# EasyEDA Pro project ProPrj_DevBoard_2026-04-14.epro

# Schematic Schematic1
Board Name: Board1; Create Date: 2026-03-25; Page Name: P1; Project Name: DevBoard; Schematic Name: Schematic1; Update Date: 2026-03-25; Company: EasyEDA.com; Page Size: A4; Version: V1.0
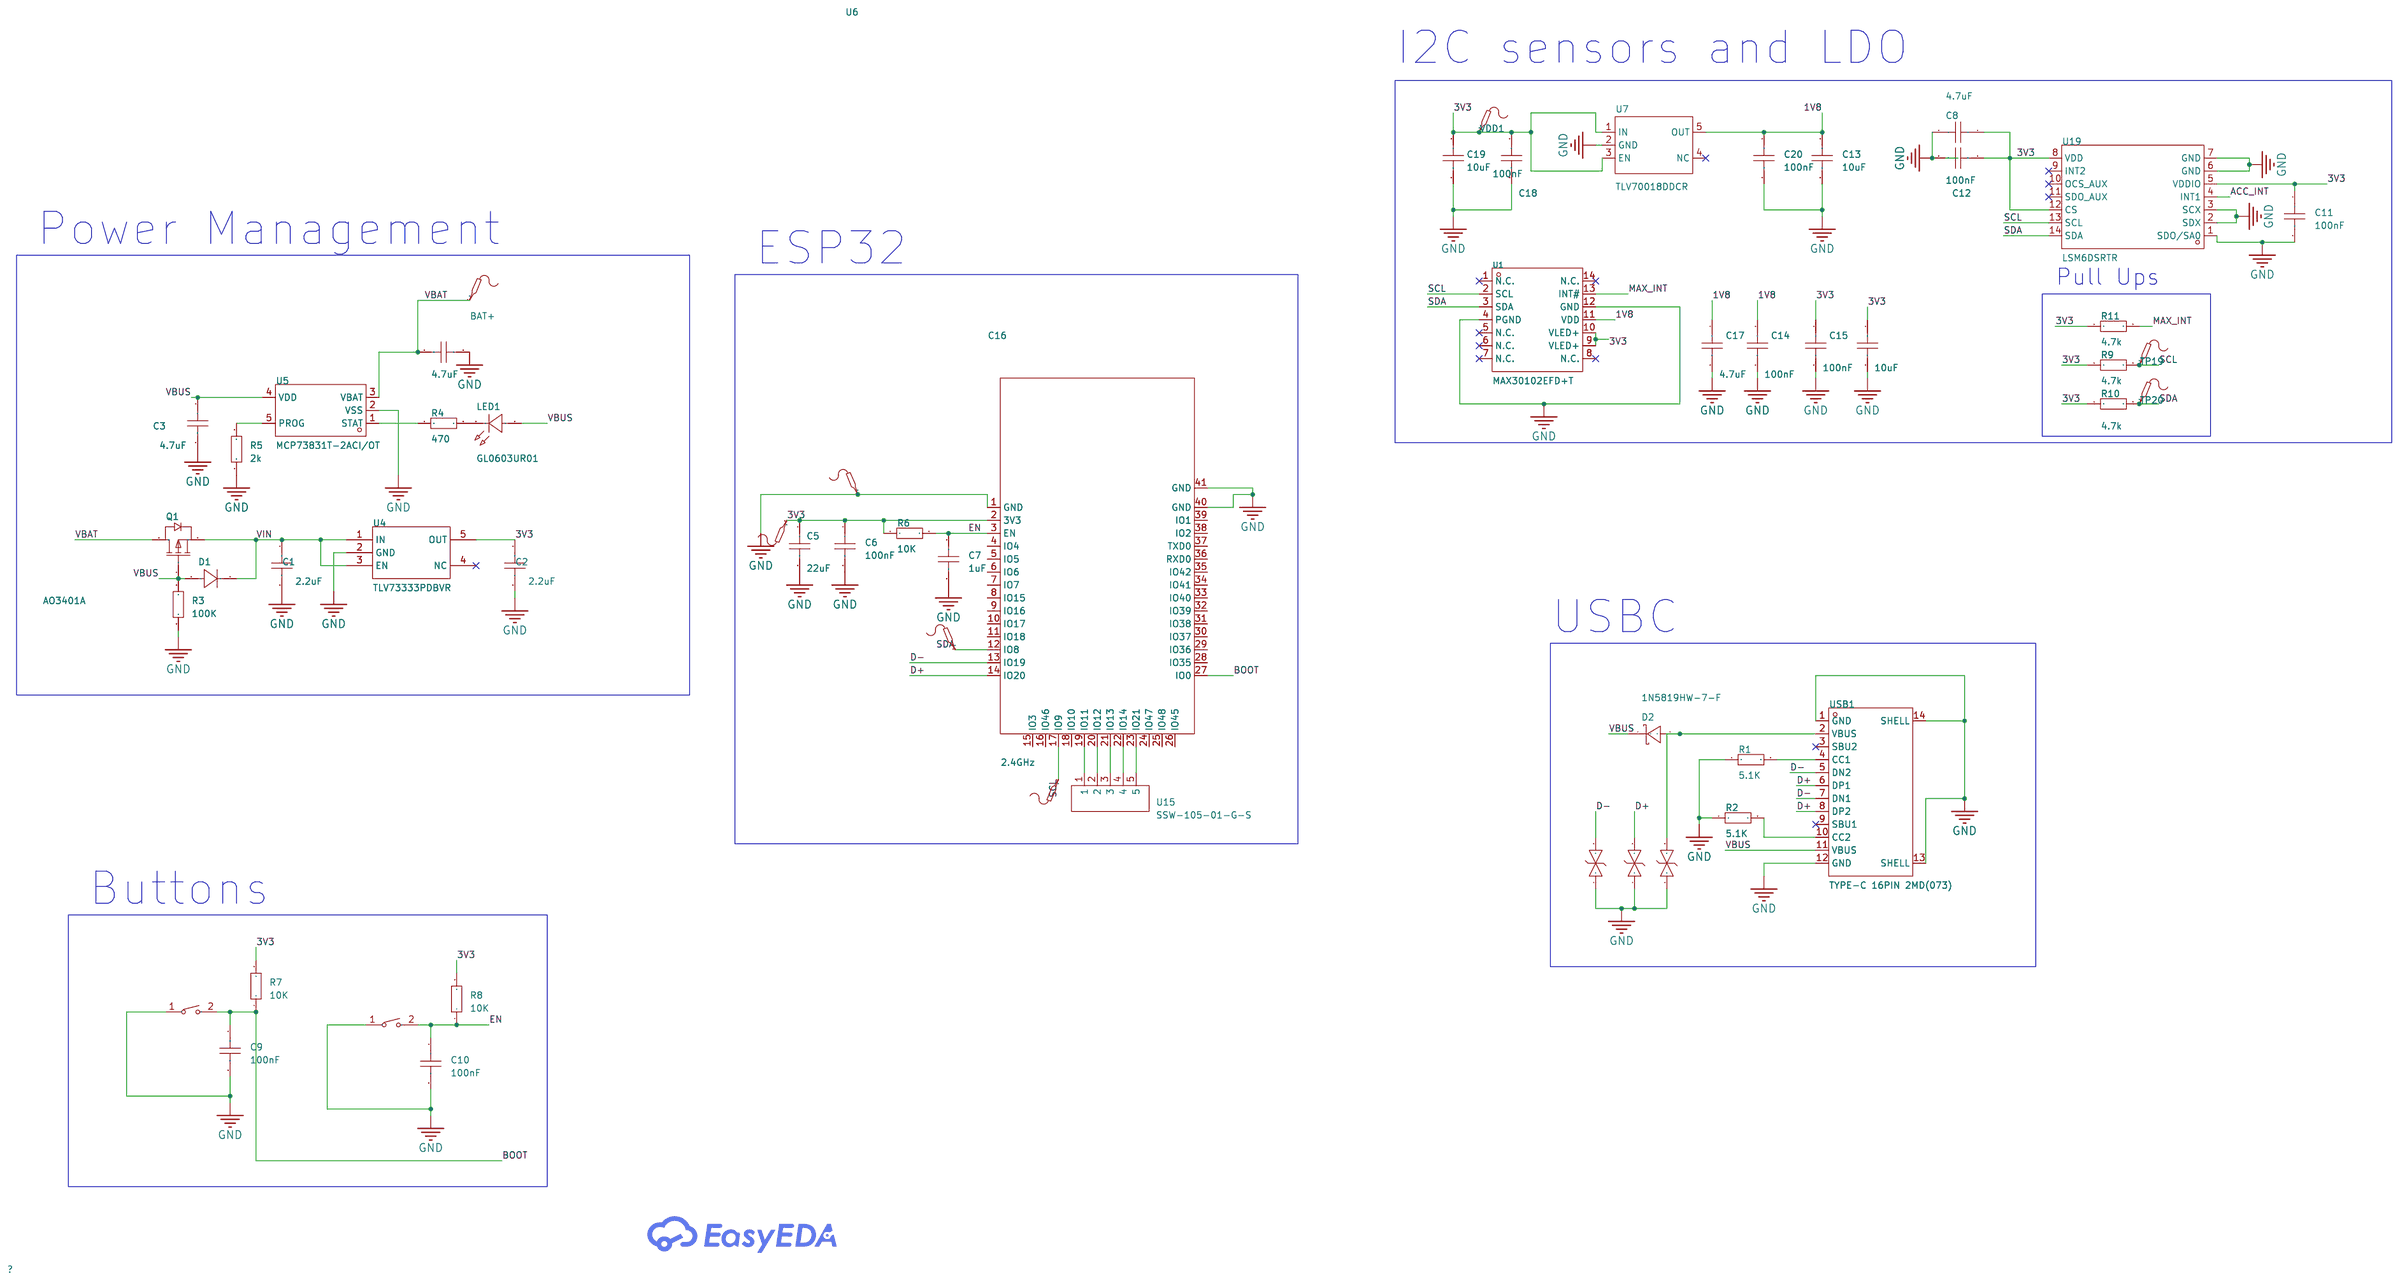
[diagram p0: schematic sheet]

## Parts
BAT+  -  [BAT_SMD]
BAT+1  -  [BAT_SMD]
BAT+2  -  [BAT_SMD]
BAT+3  -  [BAT_SMD]
BAT+4  -  [BAT_SMD]
C1  2.2uF  [C0603]
C2  2.2uF  [C0603]
C3  4.7uF  [C0603]
C4  4.7uF  [C0603]
C5  22uF  [C0603]
C6  100nF  [C0603]
C7  1uF  [C0603]
C8  4.7uF  [C0603]
C9  100nF  [C0603]
C10  100nF  [C0603]
C11  100nF  [C0603]
C12  100nF  [C0603]
C13  10uF  [C0603]
C14  100nF  [C0603]
C15  100nF  [C0603]
C16  10uF  [C0603]
C17  4.7uF  [C0603]
C18  100nF  [C0603]
C19  10uF  [C0603]
C20  100nF  [C0603]
D1  -  [SMA_L4.4-W2.8-LS5.4-RD]
D2  1N5819HW-7-F  [SOD-123_L2.7-W1.6-LS3.7-RD]
LED1  GL0603UR01  [LED0603-FD]
Q1  AO3401A  [SOT-23_L2.9-W1.3-P1.90-LS2.4-BR]
R1  5.1K  [R0603]
R2  5.1K  [R0603]
R3  100K  [R0603]
R4  470  [R0603]
R5  2k  [R0603]
R6  10K  [R0603]
R7  10K  [R0603]
R8  10K  [R0603]
R9  4.7k  [R0603]
R10  4.7k  [R0603]
R11  4.7k  [R0603]
TP19  -  [Test-Point-0.5mm]
TP20  -  [Test-Point-0.5mm]
U1  MAX30102EFD+T  [OESIP-14_L5.6-W3.3-P0.80-TL]
U4  TLV73333PDBVR  [SOT-23-5_L3.0-W1.7-P0.95-LS2.8-BR]
U5  MCP73831T-2ACI/OT  [SOT-23-5_L3.0-W1.7-P0.95-LS2.8-BL]
U6  2.4GHz  [WIRELM-SMD_ESP32-S3-WROOM-1]
U7  TLV70018DDCR  [SOT-23-5_L3.0-W1.7-P0.95-LS2.8-BR]
U8  GT-TC060A-H025-L1  [SW-SMD_L6.1-W3.5-LS8.0]
U9  GT-TC060A-H025-L1  [SW-SMD_L6.1-W3.5-LS8.0]
U15  SSW-105-01-G-S  [HDR-TH_5P-P2.54_SSW-105-01-S-P]
U16  LESD5D5.0CT1G  [SOD-523_L1.2-W0.8-LS1.6-BI]
U17  LESD5D5.0CT1G  [SOD-523_L1.2-W0.8-LS1.6-BI]
U18  LESD5D5.0CT1G  [SOD-523_L1.2-W0.8-LS1.6-BI]
U19  LSM6DSRTR  [LGA-14_L3.0-W2.5-P0.50-BR]
USB1  TYPE-C 16PIN 2MD(073)  [USB-C-SMD_TYPE-C-6PIN-2MD-073]
VDD1  -  [Test-Point-0.5mm]

## Library data of the parts
BAT+ BAT+1-BAT+4 TP19 TP20 VDD1 = Test-Point: Test Point 测试点
C1-C20 = CAP_0603: Supplier Footprint: 0603
D1 = 1N4007: Supplier Footprint: SMA(DO-214AC); Supplier Part: C727081
D2 = 1N5819HW-7-F: Diode Configuration:1 Independent Voltage - Forward(Vf@If):450mV@1A Voltage - DC Reverse(Vr):40V Current - Rectified:1A Reverse Leakage Current (Ir):1mA@40V Operating Junction Temperature Range:-65℃~+150℃ Operating Junction Temperature Range:-65℃~+150℃ No; LCSC Part Name: 电压:40V 电流:1A; Supplier Part: C82544; Manufacturer: DIODES(美台); Supplier Footprint: SOD-123; JLCPCB Part Class: Extended Part; Datasheet: https://item.szlcsc.com/datasheet/1N5819HW-7-F/83701.html; Supplier: LCSC; Diode Configuration: 1 Independent; Voltage - Forward(Vf@If): 450mV@1A; Voltage - DC Reverse(Vr): 40V; Current - Rectified: 1A; Reverse Leakage Current (Ir): 1mA@40V; Operating Junction Temperature Range: -65℃~+150℃; Non-Repetitive Peak Forward Surge Current: 25A
LED1 = GL0603UR01: Illumination Color:Red Voltage - Forward(Vf):2.4V Voltage - Forward(Vf):2.4V Forward Current:20mA Wavelength - Dominant:620nm~625nm Wavelength - Dominant:620nm~625nm Diode Configuration:Discrete Diode Lens Color:Water Clear Luminous Intensity:120mcd Lumin; LCSC Part Name: 0603 红灯 高亮; Supplier Part: C51933292; Manufacturer: Guiguang light(桂光光电); Supplier Footprint: 0603; JLCPCB Part Class: Extended Part; Datasheet: https://item.szlcsc.com/datasheet/GL0603UR01/54645988.html; Supplier: LCSC; Illumination Color: Red; Voltage - Forward(Vf): 2.4V; Forward Current: 20mA; Wavelength - Dominant: 620nm~625nm; Diode Configuration: Discrete Diode; Lens Color: Water Clear; Luminous Intensity: 120mcd; Viewing Angle: 120°; Mounting Style: Top-mount; Operating Temperature: -40℃~+85℃
Q1 = AO3401A_C15127: Number:1 P-Channel Drain to Source Voltage:30V Current - Continuous Drain(Id):4A RDS(on):47mΩ@10V；85mΩ@2.5V；60mΩ@4.5V Pd - Power Dissipation:- Gate Threshold Voltage (Vgs(th)):900mV@250uA Gate Charge(Qg):14nC@10V Input Capacitance(Ciss):645pF Reverse Tran; LCSC Part Name: 1个P沟道 耐压:30V 电流:4A; Supplier Part: C15127; Manufacturer: AOS; Supplier Footprint: SOT-23; JLCPCB Part Class: Basic Part; Datasheet: https://item.szlcsc.com/datasheet/AO3401A/15801.html; Supplier: LCSC; Number: 1 P-Channel; Drain to Source Voltage: 30V; Current - Continuous Drain(Id): 4A; RDS(on): 47mΩ@10V；85mΩ@2.5V；60mΩ@4.5V; Gate Threshold Voltage (Vgs(th)): 900mV@250uA; Gate Charge(Qg): 14nC@10V; Input Capacitance(Ciss): 645pF; Reverse Transfer Capacitance (Crss@Vds): 55pF; Output Capacitance(Coss): 80pF
R1-R11 = Res_0603: Supplier Footprint: 0603
U1 = MAX30102EFD+T_C6454833: Operating Temperature:-40℃~+85℃ Operating Temperature:-40℃~+85℃; LCSC Part Name: 高灵敏度脉搏血氧仪和心率传感器; Supplier Part: C6454833; Manufacturer: ADI(亚德诺)/MAXIM(美信); Supplier Footprint: OESIP-14; JLCPCB Part Class: Extended Part; Datasheet: https://item.szlcsc.com/datasheet/MAX30102EFD%252BT/7407610.html; Supplier: LCSC; Operating Temperature: -40℃~+85℃
U4 = TLV73333PDBVR: Output Type:Fixed Voltage - Supply:5.5V Output Voltage:3.3V Output Voltage:3.3V Output Current:300mA Power Supply Rejection Ratio (PSRR):50dB@(1kHz) Voltage Dropout:125mV@(300mA) standby current:34uA Noise:28uVrms Features:Under Voltage Lockout；Over Curre; LCSC Part Name: 3.3V 300mA 5.5V; Supplier Part: C134139; Manufacturer: TI(德州仪器); Supplier Footprint: SOT-23-5; JLCPCB Part Class: Extended Part; Datasheet: https://www.ti.com/cn/lit/gpn/tlv733p; Supplier: LCSC; Output Type: Fixed; Voltage - Supply: 5.5V; Output Voltage: 3.3V; Output Current: 300mA; Power Supply Rejection Ratio (PSRR): 50dB@(1kHz); Voltage Dropout: 125mV@(300mA); standby current: 34uA; Noise: 28uVrms; Features: Under Voltage Lockout；Over Current Protection；Enable；Over Temperature Protection; Operating Temperature: -40℃~+125℃@(Tj); Output Configuration: Positive; Number of Outputs: 1
U5 = MCP73831T-2ACI/OT: The Chip Type:Charging IC Voltage - Supply:3.75V~6V Voltage - Supply:3.75V~6V Charge Current - Max:550mA Charging Saturation Voltage:4.2V End-Off Voltage:- Type of Battery:Lithium Battery Number of Cells:1 Number of Cells:1 Operating Temperature:-40℃~+85℃; LCSC Part Name: 单节锂离子/锂聚合物充电管理控制器; Supplier Part: C424093; Manufacturer: MICROCHIP(美国微芯); Supplier Footprint: SOT-23-5; JLCPCB Part Class: Extended Part; Datasheet: https://item.szlcsc.com/datasheet/MCP73831T-2ACI%252FOT/417116.html; Supplier: LCSC; The Chip Type: Charging IC; Voltage - Supply: 3.75V~6V; Charge Current - Max: 550mA; Charging Saturation Voltage: 4.2V; Type of Battery: Lithium Battery; Number of Cells: 1; Operating Temperature: -40℃~+85℃; Battery Temperature Detection: Not supported; Supply Current (Iq): 53uA
U6 = ESP32-S3-WROOM-1-N16R8: Utilized IC / Part:ESP32-S3R8 Interface Type:I2C；GPIO；UART；SPI；USB；I2S Frequency:2.4GHz Antenna Type:On-board PCB Antenna Output Power:20.5dBm Output Power:20.5dBm Voltage - Supply:3V~3.6V Voltage - Supply:3V~3.6V Receive  Current:95mA Send  Current:355mA; LCSC Part Name: 不带固件 通用型Wi-Fi+低功耗蓝牙MCU模组; Supplier Part: C2913202; Manufacturer: ESPRESSIF(乐鑫); Supplier Footprint: SMD,25.5x18mm; JLCPCB Part Class: Extended Part; Datasheet: https://item.szlcsc.com/datasheet/ESP32-S3-WROOM-1-N16R8/3198300.html; Supplier: LCSC; Utilized IC / Part: ESP32-S3R8; Interface Type: I2C；GPIO；UART；SPI；USB；I2S; Antenna Type: On-board PCB Antenna; Output Power: 20.5dBm; Voltage - Supply: 3V~3.6V; Receive  Current: 95mA; Send  Current: 355mA; Sensitivity: -103.5dBm; Operating Temperature: -40℃~+65℃
U7 = TLV70018DDCR: Output Type:Fixed Maximum Input Voltage:5.5V Output Voltage:1.8V Output Voltage:1.8V Output Current:200mA Power Supply Rejection Ratio (PSRR):68dB@(1kHz) Dropout Voltage:250mV@(200mA) standby current:55uA Feature:防静电保护；低ESR；Thermal Protection(TSD)；欠压闭锁；Ov; LCSC Part Name: 具有使能功能的 200mA、高 PSRR、低 IQ、低压降稳压器; Supplier Part: C79924; Manufacturer: TI(德州仪器); Supplier Footprint: SOT-23-5; JLCPCB Part Class: Extended Part; Datasheet: https://www.ti.com/cn/lit/gpn/tlv700; Supplier: LCSC; Output Type: Fixed; Maximum Input Voltage: 5.5V; Output Voltage: 1.8V; Output Current: 200mA; Power Supply Rejection Ratio (PSRR): 68dB@(1kHz); Dropout Voltage: 250mV@(200mA); standby current: 55uA; Feature: 防静电保护；低ESR；Thermal Protection(TSD)；欠压闭锁；Overcurrent Protection(OCP)；带使能; Operating Temperature: -40℃~+125℃@(Tj); Output Polarity: Positive electrode; Number of Outputs: 1
U8 U9 = GT-TC060A-H025-L1: Circuit:SPST Actuator Style:Rectangular Button Operating Force:1.6N Mounting Type:Surface Mount,Vertical Length:6.05mm Width:3.5mm Switch Height:2.5mm with Bracket:Without Bracket Contact Current:50mA Voltage Rating:12V Actuator/Cap Color:White With Lamp:; LCSC Part Name: 3x6 两脚立式轻触开关 H2.5mm 160gf; Supplier Part: C5117870; Manufacturer: G-Switch(品赞); Supplier Footprint: SMD,6.1x3.5mm; JLCPCB Part Class: Extended Part; Datasheet: https://item.szlcsc.com/datasheet/GT-TC060A-H025-L1/5694726.html; Supplier: LCSC; Circuit: SPST; Actuator Style: Rectangular Button; Operating Force: 1.6N; Mounting Type: Surface Mount,Vertical; Length: 6.05mm; Width: 3.5mm; Switch Height: 2.5mm; with Bracket: Without Bracket; Contact Current: 50mA; Voltage Rating: 12V; Actuator/Cap Color: White; With Lamp: No; Termination Style: PC Pin; Life: 100,000 Cycles; Operating Temperature: -30℃~+85℃
U15 = SSW-105-01-G-S: Holes Structure:1x5P Pitch:2.54mm Row Spacing:- Circular Hole / Square Hole:Square Hole Mounting Type:Through Hole Number of Rows:1 Number of Positions:5P Current Rating:4.7A Voltage Rating (Max):655V Holes Direction:Top Insulation Height:8.51mm Contact P; LCSC Part Name: 1x5P 间距:2.54mm 直插; Supplier Part: C6825529; Manufacturer: SAMTEC; Supplier Footprint: 插件,P=2.54mm; JLCPCB Part Class: Extended Part; Datasheet: https://item.szlcsc.com/datasheet/SSW-105-01-G-S/7787558.html; Supplier: LCSC; Holes Structure: 1x5P; Pitch: 2.54mm; Circular Hole / Square Hole: Square Hole; Mounting Type: Through Hole; Number of Rows: 1; Number of Positions: 5P; Current Rating: 4.7A; Voltage Rating (Max): 655V; Holes Direction: Top; Insulation Height: 8.51mm; Contact Plating: Gold; Operating Temperature: -55℃~+125℃
U16-U18 = LESD5D5.0CT1G_C7433850: Polarity:- Reverse Stand-Off Voltage (Vrwm):5V Clamping Voltage:15V Peak Pulse Current (Ipp):5A Peak Pulse Power Dissipation (Ppp):75W Voltage - Breakdown:9V Reverse Leakage Current (Ir):1uA Number of Channels:1.0 Operating Temperature:-40℃~+150℃ Operatin; Supplier Part: C7433850; Manufacturer: KUU; Supplier Footprint: SOD-523; JLCPCB Part Class: Extended Part; Datasheet: https://item.szlcsc.com/datasheet/LESD5D5.0CT1G/8442902.html; Supplier: LCSC; Reverse Stand-Off Voltage (Vrwm): 5V; Clamping Voltage: 15V; Peak Pulse Current (Ipp): 5A; Peak Pulse Power Dissipation (Ppp): 75W; Voltage - Breakdown: 9V; Reverse Leakage Current (Ir): 1uA; Number of Channels: 1.0; Operating Temperature: -40℃~+150℃; level of protection: IEC 61000-4-2；IEC 61000-4-4; Type: ESD; Junction Capacitance: 15pF
U19 = LSM6DSRTR: Accelerometer Sensing Axis:X,Y,Z Acceleration Measurement Range (MAX):±16g Acceleration Measurement Range (MAX):±16g Gyroscope Sensing Axis:X,Y,Z Gyroscope Measurement Range (MAX):±4000dps Gyroscope Measurement Range (MAX):±4000dps Sensor Type:Acceleromet; LCSC Part Name: iNEMO惯性模块:常开3D加速度计和3D陀螺仪; Supplier Part: C784817; Manufacturer: ST(意法半导体); Supplier Footprint: LGA-14(2.5x3); JLCPCB Part Class: Extended Part; Datasheet: https://item.szlcsc.com/datasheet/LSM6DSRTR/840864.html; Supplier: LCSC; Accelerometer Sensing Axis: X,Y,Z; Acceleration Measurement Range (MAX): ±16g; Gyroscope Sensing Axis: X,Y,Z; Gyroscope Measurement Range (MAX): ±4000dps; Sensor Type: Accelerometer Gyroscope; Interface: I2C；SPI；MIPI I3C; Voltage - Supply: 1.71V~3.6V; Cache Size: 9KB; Operating Temperature: -40℃~+85℃
USB1 = TYPE-C 16PIN 2MD(073): Connector Type:Type-C Protocol Standard:- Gender:Female Mounting Type:Surface Mount, Right Angle Number of Contacts:16P Number of Ports:1 Current Rating-Power:3A Voltage Rating:5V Connect-Disconnect Life:5,000 times Supplementary Features:- Center Height:; LCSC Part Name: 16P卧贴母座; Supplier Part: C2765186; Manufacturer: SHOU HAN(首韩); Supplier Footprint: SMD; JLCPCB Part Class: Extended Part; Datasheet: https://item.szlcsc.com/datasheet/TYPE-C%252016PIN%25202MD(073)/2901843.html; Supplier: LCSC; Connector Type: Type-C; Gender: Female; Mounting Type: Surface Mount, Right Angle; Number of Contacts: 16P; Number of Ports: 1; Current Rating-Power: 3A; Voltage Rating: 5V; Connect-Disconnect Life: 5,000 times; Detection color: Black; Operating Temperature: -25℃~+85℃

## Nets
1V8: C13.1 C14.1 C17.1 C20.1 U1.11(VDD) U7.5(OUT)
3V3: BAT+3.1 C2.1 C5.1 C6.1 C8.1 C11.1 C12.1 C15.1 C16.1 C18.1 C19.1 R6.1 R7.2 R8.2 R9.1 R10.1 R11.1 U1.9(VLED+) U1.10(VLED+) U4.5(OUT) U6.2(3V3) U7.1(IN) U7.3(EN) U19.5(VDDIO) U19.8(VDD) U19.12(CS) VDD1.1
GND: BAT+4.1 C1.2 C2.2 C3.2 C4.2 C5.2 C6.2 C7.2 C8.2 C9.2 C10.2 C11.2 C12.2 C13.2 C14.2 C15.2 C16.2 C17.2 C18.2 C19.2 C20.2 R1.1 R2.1 R3.1 R5.1 U1.4(PGND) U1.12(GND) U4.2(GND) U5.2(VSS) U6.1(GND) U6.40(GND) U6.41(GND) U7.2(GND) U8.1 U9.1 U16.1 U17.1 U18.1 U19.1(SDO/SA0) U19.2(SDX) U19.3(SCX) U19.6(GND) U19.7(GND) USB1.1(GND) USB1.12(GND) USB1.13(SHELL) USB1.14(SHELL)
VBAT: BAT+.1 C4.1 Q1.3(D) U5.3(VBAT)
VBUS: C3.1 D1.2(A) D2.1(K) LED1.1(A) Q1.1(G) R3.2 U5.4(VDD) USB1.11(VBUS)
VIN: C1.1 D1.1(K) Q1.2(S) U4.1(IN) U4.3(EN)
ACC_INT: U19.4(INT1)
BOOT: C9.1 R7.1 U6.27(IO0) U8.2
D+: U6.14(IO20) U17.2 USB1.6(DP1) USB1.8(DP2)
D-: U6.13(IO19) U16.2 USB1.5(DN2) USB1.7(DN1)
EN: C7.1 C10.1 R6.2 R8.1 U6.3(EN) U9.2
MAX_INT: R11.2 U1.13(INT#)
SCL: BAT+1.1 R9.2 TP19.1 U1.2(SCL) U6.17(IO9) U19.13(SCL)
SDA: BAT+2.1 R10.2 TP20.1 U1.3(SDA) U6.12(IO8) U19.14(SDA)
$1N1234: D2.2(A) U18.2 USB1.2(VBUS)
$1N4701: U6.19(IO11) U15.1
$1N4705: U6.20(IO12) U15.2
$1N4710: U6.21(IO13) U15.3
$1N4715: U6.22(IO14) U15.4
$1N4720: U6.23(IO21) U15.5
Net-(LED1-2): LED1.2(C) R4.2
Net-(R1-2): R1.2 USB1.4(CC1)
Net-(R2-2): R2.2 USB1.10(CC2)
Net-(R4-1): R4.1 U5.1(STAT)
Net-(R5-2): R5.2 U5.5(PROG)

Not connected (* = marked no-connect by the designer): U1 1(N.C.)* 5(N.C.)* 6(N.C.)* 7(N.C.)* 8(N.C.)* 14(N.C.)*; U4 4(NC)*; U6 4(IO4) 5(IO5) 6(IO6) 7(IO7) 8(IO15) 9(IO16) 10(IO17) 11(IO18) 15(IO3) 16(IO46) 18(IO10) 24(IO47) 25(IO48) 26(IO45) 28(IO35) 29(IO36) 30(IO37) 31(IO38) 32(IO39) 33(IO40) 34(IO41) 35(IO42) 36(RXD0) 37(TXD0) 38(IO2) 39(IO1); U7 4(NC)*; U19 9(INT2)* 10(OCS_AUX)* 11(SDO_AUX)*; USB1 3(SBU2)* 9(SBU1)*

## Notes on the sheet
- I2C sensors and LDO
- Power Management
- ESP32
- Pull Ups
- USBC
- Buttons

# Board PCB1
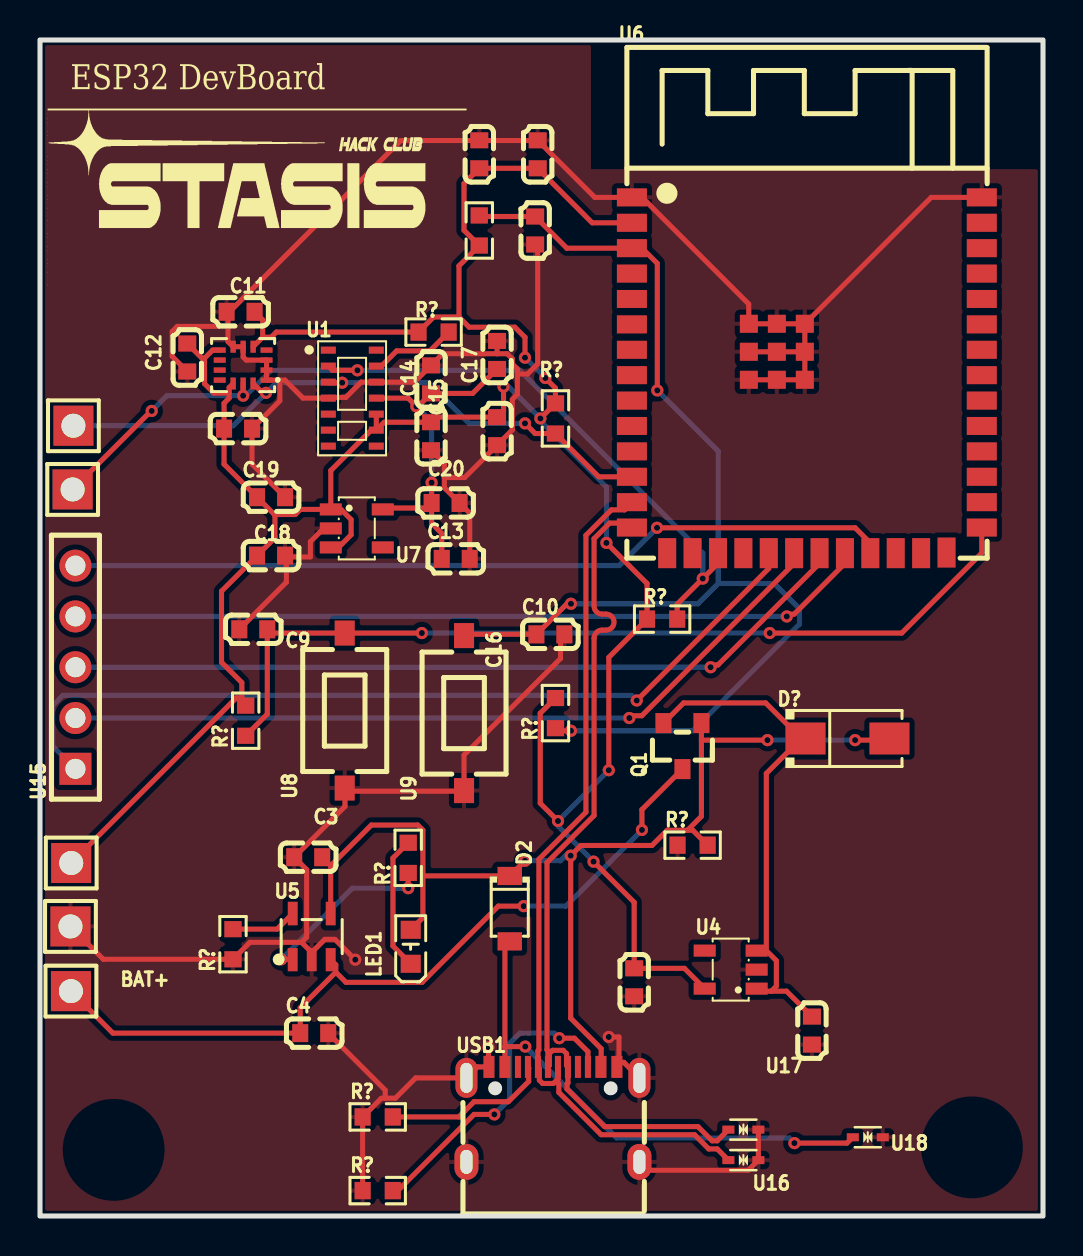
[diagram p1: board, top side]
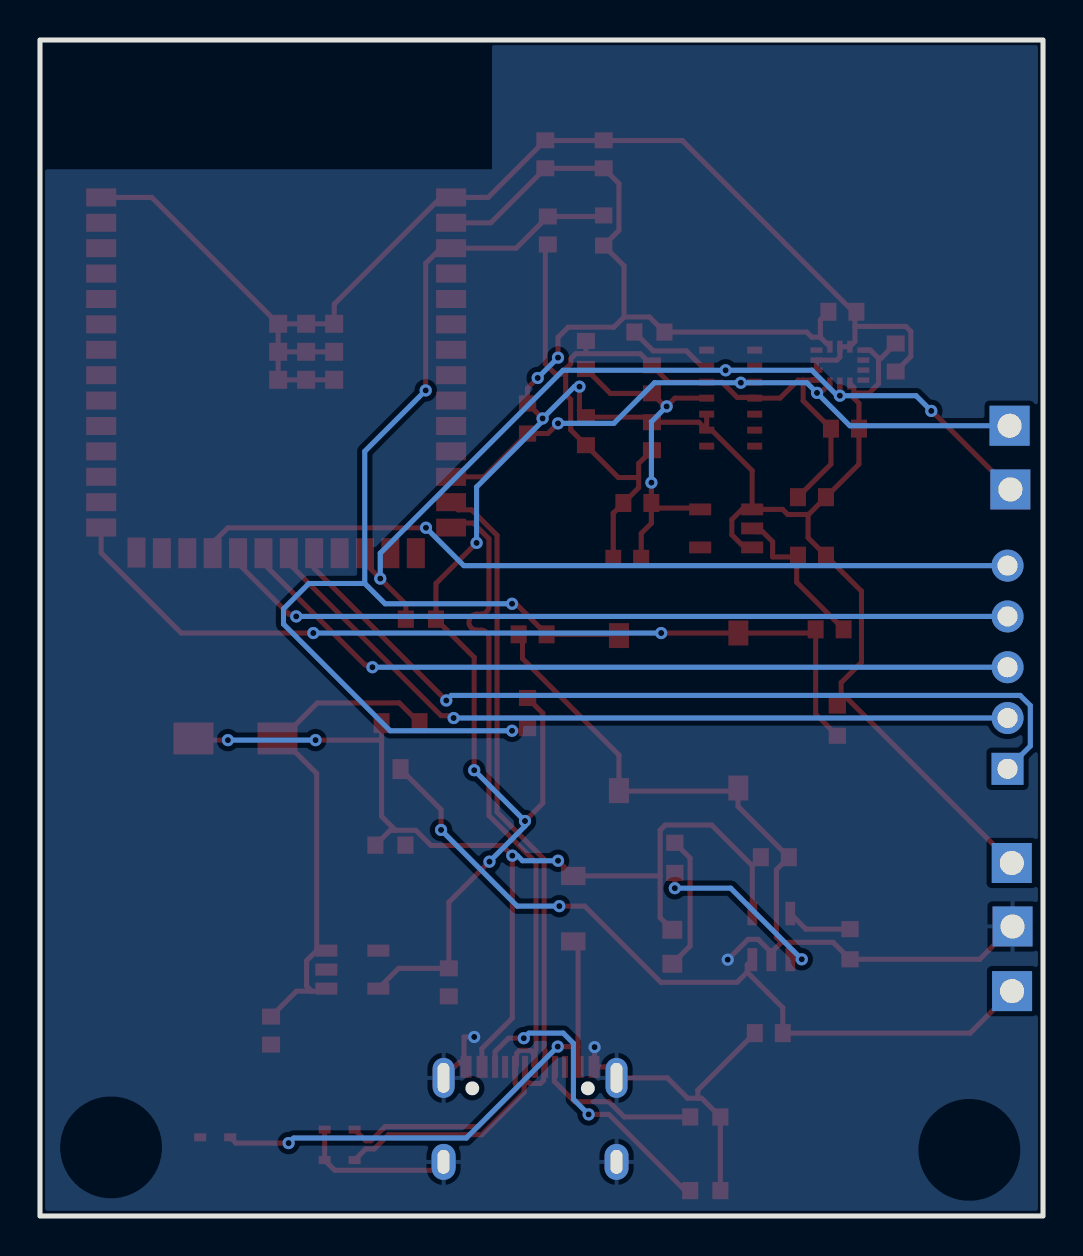
[diagram p2: board, bottom side, seen from below]

Outline 50.16 x 58.8 mm; copper layers: Top Layer, Bottom Layer. Coordinates in mm from the lower left corner of the outline.
Outline path: rectangle 0,58.8 50.16,0
Stack: Top Layer 0.035mm / Dielectric1 1.51mm FR4 er 4.5 / Bottom Layer 0.035mm

## Design rules (mm)
net D-: DP1
net D+: DP1
template: JLCPCB Capability(Two Layers Board)
spacing copperThickness1oz (default): track to track 0.102, other pairs 0.152 to 0.3
spacing copperThickness2oz: track to track 0.203, other pairs 0.152 to 0.3
track width copperThickness1oz (default): min 0.127, default 0.254, max 2.54
track width copperThickness2oz: min 0.203, default 0.254, max 2.54
differential pair differentialPair (default): width min 0.127, default 0.254, max 2.54; gap min 0.152, default 0.152
via viaSize (default): diameter min 0.5, default 0.61, max 10; hole min 0.3, default 0.305, max 6.3

## Placement (name value [footprint] x y rotation side)
BAT+  -  [BAT_SMD]  1.55 11.24 0 top
BAT+1  -  [BAT_SMD]  1.63 36.33 0 top
BAT+2  -  [BAT_SMD]  1.67 39.51 0 top
BAT+3  -  [BAT_SMD]  1.56 17.65 0 top
BAT+4  -  [BAT_SMD]  1.52 14.48 0 top
C1  2.2uF  [C0603]  38.61 9.27 270 top
C2  2.2uF  [C0603]  29.72 11.68 270 top
C3  4.7uF  [C0603]  13.41 17.94 180 top
C4  4.7uF  [C0603]  13.72 9.14 0 top
C5  22uF  [C0603]  21.97 53.09 90 top
C6  100nF  [C0603]  24.89 53.09 90 top
C7  1uF  [C0603]  24.76 49.28 270 top
C8  4.7uF  [C0603]  9.91 39.37 0 top
C9  100nF  [C0603]  10.67 29.34 180 top
C10  100nF  [C0603]  25.53 29.08 0 top
C11  100nF  [C0603]  10.03 45.21 180 top
C12  100nF  [C0603]  7.37 42.93 270 top
C13  10uF  [C0603]  20.79 32.86 0 top
C14  100nF  [C0603]  19.56 41.83 90 top
C15  100nF  [C0603]  19.56 38.99 270 top
C16  10uF  [C0603]  22.86 39.24 270 top
C17  4.7uF  [C0603]  22.86 43.05 90 top
C18  100nF  [C0603]  11.56 33.02 0 top
C19  10uF  [C0603]  11.56 35.94 0 top
C20  100nF  [C0603]  20.29 35.65 0 top
D2  1N5819HW-7-F  [SOD-123_L2.7-W1.6-LS3.7-RD]  23.5 15.37 270 top
D?  1N4007  [SMA_L4.3-W2.5-LS5.0-RD]  40.39 23.88 0 top
LED1  GL0603UR01  [LED0603-FD]  18.54 13.46 270 top
Q1  AO3401A  [SOT-23_L2.9-W1.3-P1.90-LS2.4-BR]  32.13 23.5 90 top
R?  -  [R0603]  32.64 18.54 0 top
R?#2  -  [R0603]  18.41 17.91 90 top
R?#3  -  [R0603]  9.65 13.59 90 top
R?#4  -  [R0603]  21.97 49.28 90 top
R?#5  -  [R0603]  10.29 24.77 90 top
R?#6  -  [R0603]  25.78 25.15 90 top
R?#7  -  [R0603]  31.11 29.85 0 top
R?#8  -  [R0603]  25.78 39.88 270 top
R?#9  -  [R0603]  19.69 44.2 0 top
R?#10  -  [R0603]  16.89 4.95 0 top
R?#11  -  [R0603]  16.89 1.27 0 top
U1  MAX30102EFD+T  [OESIP-14_L5.6-W3.3-P0.80-TL]  15.62 40.89 0 top
U4  TLV73333PDBVR  [SOT-23-5_L3.0-W1.7-P0.95-LS2.8-BR]  34.54 12.32 0 top
U5  MCP73831T-2ACI/OT  [SOT-23-5_L3.0-W1.7-P0.95-LS2.8-BL]  13.59 13.97 0 top
U6  2.4GHz  [WIRELM-SMD_ESP32-S3-WROOM-1]  38.35 42.04 0 top
U7  TLV70018DDCR  [SOT-23-5_L3.0-W1.7-P0.95-LS2.8-BR]  15.84 34.38 180 top
U8  GT-TC060A-H025-L1  [SW-SMD_L6.1-W3.5-LS8.0]  15.24 25.27 90 top
U9  GT-TC060A-H025-L1  [SW-SMD_L6.1-W3.5-LS8.0]  21.21 25.15 90 top
U15  SSW-105-01-G-S  [HDR-TH_5P-P2.54_SSW-105-01-S-P]  1.77 27.44 90 top
U16  LESD5D5.0CT1G  [SOD-523_L1.2-W0.8-LS1.6-BI]  35.18 2.79 180 top
U17  LESD5D5.0CT1G  [SOD-523_L1.2-W0.8-LS1.6-BI]  35.18 4.32 180 top
U18  LESD5D5.0CT1G  [SOD-523_L1.2-W0.8-LS1.6-BI]  41.4 3.94 180 top
U19  LSM6DSRTR  [LGA-14_L3.0-W2.5-P0.50-BR]  10.16 42.55 0 top
USB1  TYPE-C 16PIN 2MD(073)  [USB-C-SMD_TYPE-C-6PIN-2MD-073]  25.65 5.08 0 top

## Footprints (pads in the part's own frame, mm; a bottom-side part is the same pattern mirrored in y, then rotated)
BAT_SMD
  rect 2x2 hole 1.2: 1(0,0)
C0603
  rect 0.8x0.9 smd: 1(-0.7,0) 2(0.7,0)
HDR-TH_5P-P2.54_SSW-105-01-S-P
  rect 1.6x1.6 hole 1: 1(-5.08,0)
  round 1.6 hole 1: 2(-2.54,0) 3(0,0) 4(2.54,0) 5(5.08,0)
LED0603-FD
  rect 0.9x1 smd: 1(-0.85,0) 2(0.85,0)
LGA-14_L3.0-W2.5-P0.50-BR
  rect 0.6x0.27 smd: 1(1.17,-0.75) 2(1.17,-0.25) 3(1.17,0.25) 4(1.17,0.75) 8(-1.17,0.75) 9(-1.17,0.25) 10(-1.17,-0.25) 11(-1.17,-0.75)
  rect 0.27x0.6 smd: 5(0.5,0.92) 6(0,0.92) 7(-0.5,0.92) 12(-0.5,-0.92) 13(0,-0.92) 14(0.5,-0.92)
OESIP-14_L5.6-W3.3-P0.80-TL
  rect 0.75x0.35 smd: 1(-1.2,2.4) 2(-1.2,1.6) 3(-1.2,0.8) 4(-1.2,0) 5(-1.2,-0.8) 6(-1.2,-1.6) 7(-1.2,-2.4) 8(1.2,-2.4) 9(1.2,-1.6) 10(1.2,-0.8) 11(1.2,0) 12(1.2,0.8) 13(1.2,1.6) 14(1.2,2.4)
R0603
  rect 0.806x0.864 smd: 1(-0.753,0) 2(0.753,0)
SMA_L4.3-W2.5-LS5.0-RD
  rect 2x1.593 smd: 1(-2.1,0) 2(2.1,0)
SOD-123_L2.7-W1.6-LS3.7-RD
  rect 0.91x1.22 smd: 1(-1.635,0) 2(1.635,0)
SOD-523_L1.2-W0.8-LS1.6-BI
  rect 0.6x0.4 smd: 1(-0.75,0) 2(0.75,0)
SOT-23-5_L3.0-W1.7-P0.95-LS2.8-BL
  rect 0.49x1.157 smd: 1(-0.95,-1.153) 2(0,-1.153) 3(0.95,-1.153)
  rect 0.49x1.175 smd: 4(0.95,1.153) 5(-0.95,1.153)
SOT-23-5_L3.0-W1.7-P0.95-LS2.8-BR
  rect 1.1x0.6 smd: 1(1.3,-0.95) 2(1.3,0) 3(1.3,0.95) 4(-1.3,0.95) 5(-1.3,-0.95)
SOT-23_L2.9-W1.3-P1.90-LS2.4-BR
  rect 1x0.8 smd: 1(1.15,-0.95) 2(1.15,0.95) 3(-1.15,0)
SW-SMD_L6.1-W3.5-LS8.0
  rect 1.25x1 smd: 1(-3.875,0) 2(3.875,0)
USB-C-SMD_TYPE-C-6PIN-2MD-073
  rect 0.55x1.1 smd: 1(-3.2,2.375) 2(-2.4,2.375) 11(2.4,2.375) 12(3.2,2.375)
  rect 0.3x1.1 smd: 3(-1.75,2.375) 4(-1.25,2.375) 5(-0.75,2.375) 6(-0.25,2.375) 7(0.25,2.375) 8(0.75,2.375) 9(1.25,2.375) 10(1.75,2.375)
  oval 1.1x2 hole 0.6x1.5: 13(-4.325,1.825) 14(4.325,1.825)
  oval 1.2x1.8 hole 0.6x1.2: 13(-4.325,-2.375) 14(4.325,-2.375)
WIRELM-SMD_ESP32-S3-WROOM-1
  rect 1.5x0.9 smd: 1(-8.75,8.895) 2(-8.75,7.625) 3(-8.75,6.355) 4(-8.75,5.085) 5(-8.75,3.815) 6(-8.75,2.545) 7(-8.75,1.275) 8(-8.75,0.005) 9(-8.75,-1.265) 10(-8.75,-2.535) 11(-8.75,-3.805) 12(-8.75,-5.075) 13(-8.75,-6.345) 14(-8.75,-7.615) 27(8.75,-7.615) 28(8.75,-6.345) 29(8.75,-5.075) 30(8.75,-3.805) 31(8.75,-2.535) 32(8.75,-1.265) 33(8.75,0.005) 34(8.75,1.275) 35(8.75,2.545) 36(8.75,3.815) 37(8.75,5.085) 38(8.75,6.355) 39(8.75,7.625) 40(8.75,8.895)
  rect 0.9x1.5 smd: 15(-6.985,-8.895) 16(-5.715,-8.895) 17(-4.445,-8.895) 18(-3.175,-8.895) 19(-1.905,-8.895) 20(-0.635,-8.895) 21(0.635,-8.895) 22(1.905,-8.895) 23(3.175,-8.895) 24(4.445,-8.895) 25(5.715,-8.895) 26(6.985,-8.865)
  rect 0.9x0.9 smd: 41(-2.9,2.575) 41(-2.9,1.175) 41(-2.9,-0.225) 41(-1.5,2.575) 41(-1.5,1.175) 41(-1.5,-0.225) 41(-0.1,2.575) 41(-0.1,1.175) 41(-0.1,-0.225)

## Nets
1V8: C13.1 C14.1 C17.1 C20.1 U1.11 U7.5
3V3: BAT+3.1 C2.1 C5.1 C6.1 C8.1 C11.1 C12.1 C15.1 C16.1 C18.1 C19.1 R?#4.1 R?#5.2 R?#6.2 R?#7.1 R?#8.1 R?#9.1 U1.9 U1.10 U4.5 U6.2 U7.1 U7.3 U19.5 U19.8 U19.12
GND: BAT+4.1 C1.2 C2.2 C3.2 C4.2 C5.2 C6.2 C7.2 C8.2 C9.2 C10.2 C11.2 C12.2 C13.2 C14.2 C15.2 C16.2 C17.2 C18.2 C19.2 C20.2 R?.1 R?#3.1 R?#10.1 R?#11.1 U1.4 U1.12 U4.2 U5.2 U6.1 U6.40 U6.41 U7.2 U8.1 U9.1 U16.1 U17.1 U18.1 U19.1 U19.2 U19.3 U19.6 U19.7 USB1.1 USB1.12 USB1.13 USB1.14
VBAT: BAT+.1 C4.1 Q1.3 U5.3
VBUS: C3.1 D2.1 D?.2 LED1.1 Q1.1 R?.2 U5.4 USB1.11
VIN: C1.1 D?.1 Q1.2 U4.1 U4.3
ACC_INT: U19.4
BOOT: C9.1 R?#5.1 U6.27 U8.2
D+: U6.14 U17.2 USB1.6 USB1.8
D-: U6.13 U16.2 USB1.5 USB1.7
EN: C7.1 C10.1 R?#4.2 R?#6.1 U6.3 U9.2
MAX_INT: R?#9.2 U1.13
SCL: BAT+1.1 R?#7.2 U1.2 U6.17 U19.13
SDA: BAT+2.1 R?#8.2 U1.3 U6.12 U19.14
$1N1234: D2.2 U18.2 USB1.2
$1N1413: R?#10.2 USB1.4
$1N1417: R?#11.2 USB1.10
$1N2229: LED1.2 R?#2.2
$1N2233: R?#2.1 U5.1
$1N2261: R?#3.2 U5.5
$1N4701: U6.19 U15.1
$1N4705: U6.20 U15.2
$1N4710: U6.21 U15.3
$1N4715: U6.22 U15.4
$1N4720: U6.23 U15.5

Pads without a net: U1 1 5 6 7 8 14; U4 4; U6 4 5 6 7 8 9 10 11 15 16 18 24 25 26 28 29 30 31 32 33 34 35 36 37 38 39; U7 4; U19 9 10 11; USB1 3 9

## Via types
v1: diameter 0.61, hole 0.305, Top Layer to Bottom Layer, 42 vias

## Routing (per net, layer and track width the routed paths; a pad name or vN(x,y) marks a point on that pad's centre or on a via; arc(x,y) is an arc through that point)
1V8: length 17.6
  Top Layer w0.254: 19.59,35.4 19.59,34.64 20.09,34.13 C13.1 ; 19.59,35.4 C20.1 v1(19.59,36.67) ; 19.59,35.4 17.21,35.4 U7.5 ; C17.1 21.64,41.13 19.56,41.13 18.91,40.48 v1(18.82,40.48) 18.41,40.89 16.82,40.89
  Bottom Layer w0.254: v1(19.59,36.67) 19.59,39.72 v1(18.82,40.48)
3V3: length 140.4
  Top Layer w0.254: v1(28.33,33.66) 30.36,31.62 R?#7.1 28.45,27.93 v1(28.45,22.29) ; U7.1 13.02,35.33 12.77,35.08 11.75,35.08 ; U7.1 14.54,37.27 16.57,39.29 16.82,39.29 ; U7.1 15.05,35.33 15.56,34.82 15.56,34.06 14.93,33.43 U7.3 ; 9.46,41.15 9.46,41.43 U19.12 ; 9.46,41.15 8.7,41.15 8.23,41.62 8.23,42.89 ; 9.46,41.15 9.46,40.89 9.21,40.64 C8.1 9.21,37.59 C19.1 11.72,35.08 11.75,35.08 ; v1(25.27,41.9) 25.78,41.39 R?#8.1 v1(25.03,39.88) ; v1(27.69,17.72) 29.72,15.69 C2.1 32.23,12.38 U4.5 ; 20.95,44.95 21.46,44.44 23.75,44.44 24.26,43.93 v1(24.26,42.92) ; 20.95,44.95 20.95,47.51 R?#4.1 21.21,49.28 21.21,51.62 C5.1 C6.1 27.62,49.66 U6.2 ; 20.95,44.95 19.69,44.95 R?#9.1 11.82,44.2 11.57,43.94 11.14,43.94 ; 10.09,25.91 10.09,26.67 9.08,27.69 9.08,31.24 C18.1 11.75,33.91 11.75,35.08 ; 10.09,25.91 10.09,25.71 R?#5.2 ; 10.09,25.91 9.82,25.91 BAT+3.1 ; 11.14,43.94 U19.5 ; 11.14,43.94 11.14,44.81 10.73,45.21 ; 8.23,42.89 8.1,42.89 C12.1 ; 8.23,42.89 8.64,43.3 U19.8 ; v1(25.91,19.75) 25.02,20.64 25.02,25.14 R?#6.2 ; 16.82,39.29 17.22,39.69 C15.1 19.81,39.94 C16.1 23.18,40.27 v1(23.18,41.47) ; 16.82,39.29 16.82,40.09
  Bottom Layer w0.254: v1(27.69,17.72) 25.91,19.5 v1(25.91,19.75) v1(28.45,22.29) ; v1(23.18,41.47) 23.44,41.47 v1(25.03,39.88) 25.03,39.75 28.33,36.45 v1(28.33,33.66) ; v1(25.27,41.9) v1(24.26,42.92)
GND: length 187.3
  Top Layer w0.254: 15.25,21.24 21.18,21.24 U9.1 21.21,23.05 26.03,27.88 26.03,28.89 C10.2 ; 15.25,21.24 15.25,20.48 C3.2 13.34,17.32 13.34,13.94 13.08,13.69 ; 15.25,21.24 U8.1 ; C7.2 24.89,48.45 24.89,42.61 24.38,42.1 23.88,42.1 ; 21.96,53.78 24.88,53.78 24.89,53.79 27.75,50.93 U6.1 30.11,50.93 35.45,45.6 U6.41 U6.41 U6.41 ; 21.96,53.78 18.04,53.78 9.41,45.14 ; 21.96,53.78 21.97,53.79 ; 13.08,13.69 13.59,13.18 ; 13.08,13.69 10.5,13.69 R?#3.1 3.17,12.84 BAT+4.1 ; v1(22.43,8.44) 22.43,7.48 USB1.1 21.88,7.46 USB1.13 18.79,6.91 17.77,5.89 17.26,5.89 ; 17.26,5.89 17.07,5.89 R?#10.1 R?#11.1 ; 17.26,5.89 17.26,6.3 C4.2 ; 20.22,36.92 21.24,36.92 C16.2 23.62,39.31 23.62,40.83 23.88,41.08 23.88,42.1 ; 20.22,36.92 20.22,37.62 C15.2 ; 20.22,36.92 20.22,36.42 C20.2 21.49,35.15 C13.2 ; U6.41 U6.41 ; U6.41 44.57,50.93 U6.40 ; U6.41 U6.41 U6.41 ; U6.41 U6.41 U6.41 U6.41 ; 23.88,42.1 23.88,42.35 23.62,42.61 23.62,42.86 23.37,43.12 22.86,43.12 ; 12.32,32.96 12.32,31.69 C9.2 ; 12.32,32.96 12.26,33.02 ; 12.32,32.96 13.52,32.96 13.52,33.72 14.03,34.23 14.39,34.23 U7.2 ; 12,41.8 12,40.76 C8.2 10.61,37.59 12.26,35.94 ; 12,41.8 U19.1 U19.2 U19.3 10.31,42.8 10.16,42.95 U19.6 U19.7 9.41,43.72 9.41,44.48 ; 12,41.8 12.25,41.8 13.15,40.89 U1.4 14.46,40.93 15.3,40.93 16.06,41.69 18.72,41.69 C14.2 20.14,43.12 22.86,43.12 ; v1(28.45,8.95) 28.96,8.95 28.96,7.68 ; 28.96,7.68 28.96,7.56 USB1.12 ; 28.96,7.68 29.2,7.68 USB1.14 ; 13.59,13.18 14.24,13.83 14.75,13.83 v1(15.77,12.82) ; 13.59,13.18 U5.2 ; 22.86,43.12 C17.2 ; USB1.14 30.4,2.29 35.42,2.29 U16.1 U17.1 ; 9.41,44.48 6.87,44.48 6.61,44.23 6.61,42.98 C12.2 ; 9.41,44.48 9.41,45.14 ; 9.41,45.14 C11.2
VBAT: length 39.4
  Top Layer w0.254: Q1.3 30.11,20.32 v1(30.11,19.3) ; v1(24.19,15.49) 22.92,15.49 19.11,11.68 15.3,11.68 14.79,12.19 ; 14.79,12.19 13.02,10.41 C4.1 3.65,9.14 BAT+.1 ; 14.79,12.19 14.79,12.56 U5.3
  Bottom Layer w0.254: v1(30.11,19.3) 26.3,15.49 v1(24.19,15.49)
VBUS: length 55.6
  Top Layer w0.254: 32.38,19.29 31.37,19.29 30.61,18.53 27.05,18.53 v1(26.54,18.02) 26.54,9.89 28.07,8.37 28.07,7.47 USB1.11 ; 32.38,19.29 33.08,19.98 33.08,23.79 ; 32.38,19.29 32.65,19.29 R?.2 ; 19.15,17.01 23.49,17.01 ; 19.15,17.01 19.15,19.29 18.9,19.55 16.57,19.55 14.54,17.51 ; 19.15,17.01 19.15,14.92 18.54,14.31 ; D2.1 v1(24.26,17.76) ; v1(40.77,23.79) 42.4,23.79 D?.2 ; 14.54,17.51 U5.4 ; 14.54,17.51 C3.1 ; 33.08,23.79 v1(36.38,23.79) ; 33.08,23.79 Q1.1
  Bottom Layer w0.254: v1(26.54,18.02) 26.29,18.02 26.03,17.76 v1(24.26,17.76) ; v1(40.77,23.79) v1(36.38,23.79)
VIN: length 25.5
  Top Layer w0.254: 36.33,13.27 36.33,22.13 38.07,23.88 36.3,25.65 32.19,25.65 Q1.2 ; 36.33,13.27 U4.3 ; 36.33,13.27 36.83,12.77 36.83,11.5 36.58,11.24 ; U4.1 35.97,11.24 36.58,11.24 ; 36.58,11.24 37.34,11.24 C1.1
BOOT: length 44.5
  Top Layer w0.254: U6.27 47.1,33.15 43.1,29.15 v1(36.5,29.15) ; R?#5.1 11.37,25.09 C9.1 11.56,29.15 U8.2 v1(19.1,29.15)
  Bottom Layer w0.254: v1(36.5,29.15) v1(19.1,29.15)
D+: length 43.6
  Top Layer w0.254: 29.34,34.65 28.49,34.65 27.71,33.87 27.71,30.49 arc(27.83,30.21) 28.11,30.09 28.31,30.09 arc(28.71,29.69) 28.31,29.29 28.11,29.29 arc(27.83,29.18) 27.71,28.89 27.71,20.02 25.36,17.67 25.36,8.31 25.4,8.26 USB1.6 25.47,7.53 25.47,8.12 25.64,8.28 26.17,8.28 26.33,8.12 26.33,7.53 USB1.8 26.4,6.65 26.36,6.6 26.36,6.35 28.24,4.47 32.91,4.47 33.62,3.76 33.87,3.76 U17.2
D-: length 43.5
  Top Layer w0.254: U6.13 29.6,35.67 29.24,35.31 28.57,35.31 27.31,34.04 27.31,20.19 24.95,17.84 24.95,8.31 24.9,8.26 USB1.5 24.97,7.38 24.97,6.79 25.14,6.63 25.68,6.63 25.9,6.85 ; 25.9,6.85 USB1.7 ; 25.9,6.85 25.9,6.65 25.95,6.6 25.95,6.18 28.07,4.06 32.74,4.06 33.45,3.35 33.87,3.35 U16.2
EN: length 60.8
  Top Layer w0.254: v1(26.56,24.26) 25.91,24.26 R?#6.1 ; R?#4.2 22.02,49.98 C7.1 26.35,48.39 U6.3 30.11,48.39 30.87,47.63 v1(30.87,41.28) ; U9.2 21.28,29.09 24.83,29.09 ; v1(26.56,30.61) 26.36,30.61 24.83,29.09 ; 24.83,29.09 C10.1
  Bottom Layer w0.254: 33.92,31.63 33.92,38.23 v1(30.87,41.28) ; 33.92,31.63 32.91,30.61 v1(26.56,30.61) ; 33.92,31.63 36.72,31.63 37.99,30.36 37.99,29.6 32.65,24.26 v1(26.56,24.26)
MAX_INT: length 4.3
  Top Layer w0.254: 16.82,42.49 17.07,42.49 17.84,43.26 19.5,43.26 R?#9.2
SCL: length 45.3
  Top Layer w0.254: U1.2 14.63,42.29 v1(15.88,42.29) ; BAT+1.1 5.56,40.25 v1(5.59,40.25) ; v1(10.16,41.02) U19.13 ; R?#7.2 31.87,30.59 v1(33.15,31.87) 33.91,32.63 U6.17
  Bottom Layer w0.254: v1(5.59,40.25) 6.35,41.02 v1(10.16,41.02) 10.29,41.02 11.56,42.29 v1(15.88,42.29) 24,42.29 33.15,33.14 v1(33.15,31.87)
SDA: length 32.3
  Top Layer w0.254: U6.12 27.94,36.96 R?#8.2 24.76,39.12 v1(24.26,39.63) ; v1(15.11,41.66) 14.45,41.66 U1.3 ; v1(11.3,41.16) 11.13,41.16 U19.14
  Bottom Layer w0.254: BAT+2.1 9.66,39.51 v1(11.3,41.16) 11.81,41.66 v1(15.11,41.66) 19.43,41.66 21.46,39.63 v1(24.26,39.63)
$1N1234: length 25.9
  Top Layer w0.254: U18.2 40.36,3.65 v1(37.73,3.65) ; D2.2 23.25,13.49 23.25,8.47 ; 23.25,8.47 v1(24.27,8.47) ; 23.25,8.47 USB1.2
  Bottom Layer w0.254: v1(37.73,3.65) 37.48,3.9 28.84,3.9 v1(24.27,8.47)
$1N1413: length 8.3
  Top Layer w0.254: USB1.4 24.44,7.42 24.44,6.73 23.43,5.72 21.71,5.72 20.95,4.95 R?#10.2
$1N1417: length 15.8
  Top Layer w0.254: USB1.10 27.4,8.22 26.73,8.89 v1(25.97,8.89) ; v1(22.72,5.08) 21.71,5.08 17.9,1.27 R?#11.2
  Bottom Layer w0.254: v1(22.72,5.08) 23.49,5.84 23.49,8.64 23.99,9.14 25.72,9.14 v1(25.97,8.89)
$1N2229: length 6.7
  Top Layer w0.254: R?#2.2 17.65,17.9 17.65,13.5 LED1.2
$1N2233: length 9.2
  Top Layer w0.254: v1(12.06,12.84) 12.62,12.84 12.64,12.82 ; R?#2.1 v1(18.41,16.39)
  Bottom Layer w0.254: v1(18.41,16.39) 15.62,16.39 v1(12.06,12.84)
$1N2261: length 3.3
  Top Layer w0.254: R?#3.2 11.86,14.34 12.64,15.12
$1N4701: length 43.3
  Top Layer w0.254: U6.19 36.45,32.38 v1(29.84,25.78)
  Bottom Layer w0.254: v1(29.84,25.78) 29.59,26.03 1.14,26.03 0.63,25.52 0.63,23.5 U15.1
$1N4705: length 39.7
  Top Layer w0.254: U6.20 37.72,32.63 30.1,25.01 29.59,25.01 v1(29.48,24.9)
  Bottom Layer w0.254: v1(29.48,24.9) U15.2
$1N4710: length 39.9
  Top Layer w0.254: v1(33.54,27.44) 33.66,27.55 33.91,27.55 38.99,32.63 38.99,33.14
  Bottom Layer w0.254: v1(33.54,27.44) U15.3
$1N4715: length 40.1
  Top Layer w0.254: v1(37.35,29.98) 37.47,30.09 37.72,30.09 40.26,32.63 U6.22
  Bottom Layer w0.254: v1(37.35,29.98) U15.4
$1N4720: length 41.4
  Top Layer w0.254: v1(30.86,34.41) 40.77,34.41 41.53,33.65 U6.23
  Bottom Layer w0.254: v1(30.86,34.41) 28.97,32.52 U15.5

## Copper pours and planes (outline as drawn; the poured copper is in the pictures)
GND on Top Layer: 0.25,58.8 50.55,58.8 50.55,0.13 0.25,0.13
GND on Bottom Layer: -0.25,58.93 50.04,58.93 50.04,0.13 -0.25,0.13

## Text on the board
Top Silkscreen Layer: ESP32 DevBoard
